# EasyEDA Pro project 第十二届蓝桥杯EDA国赛真题.eprj, board PCB7
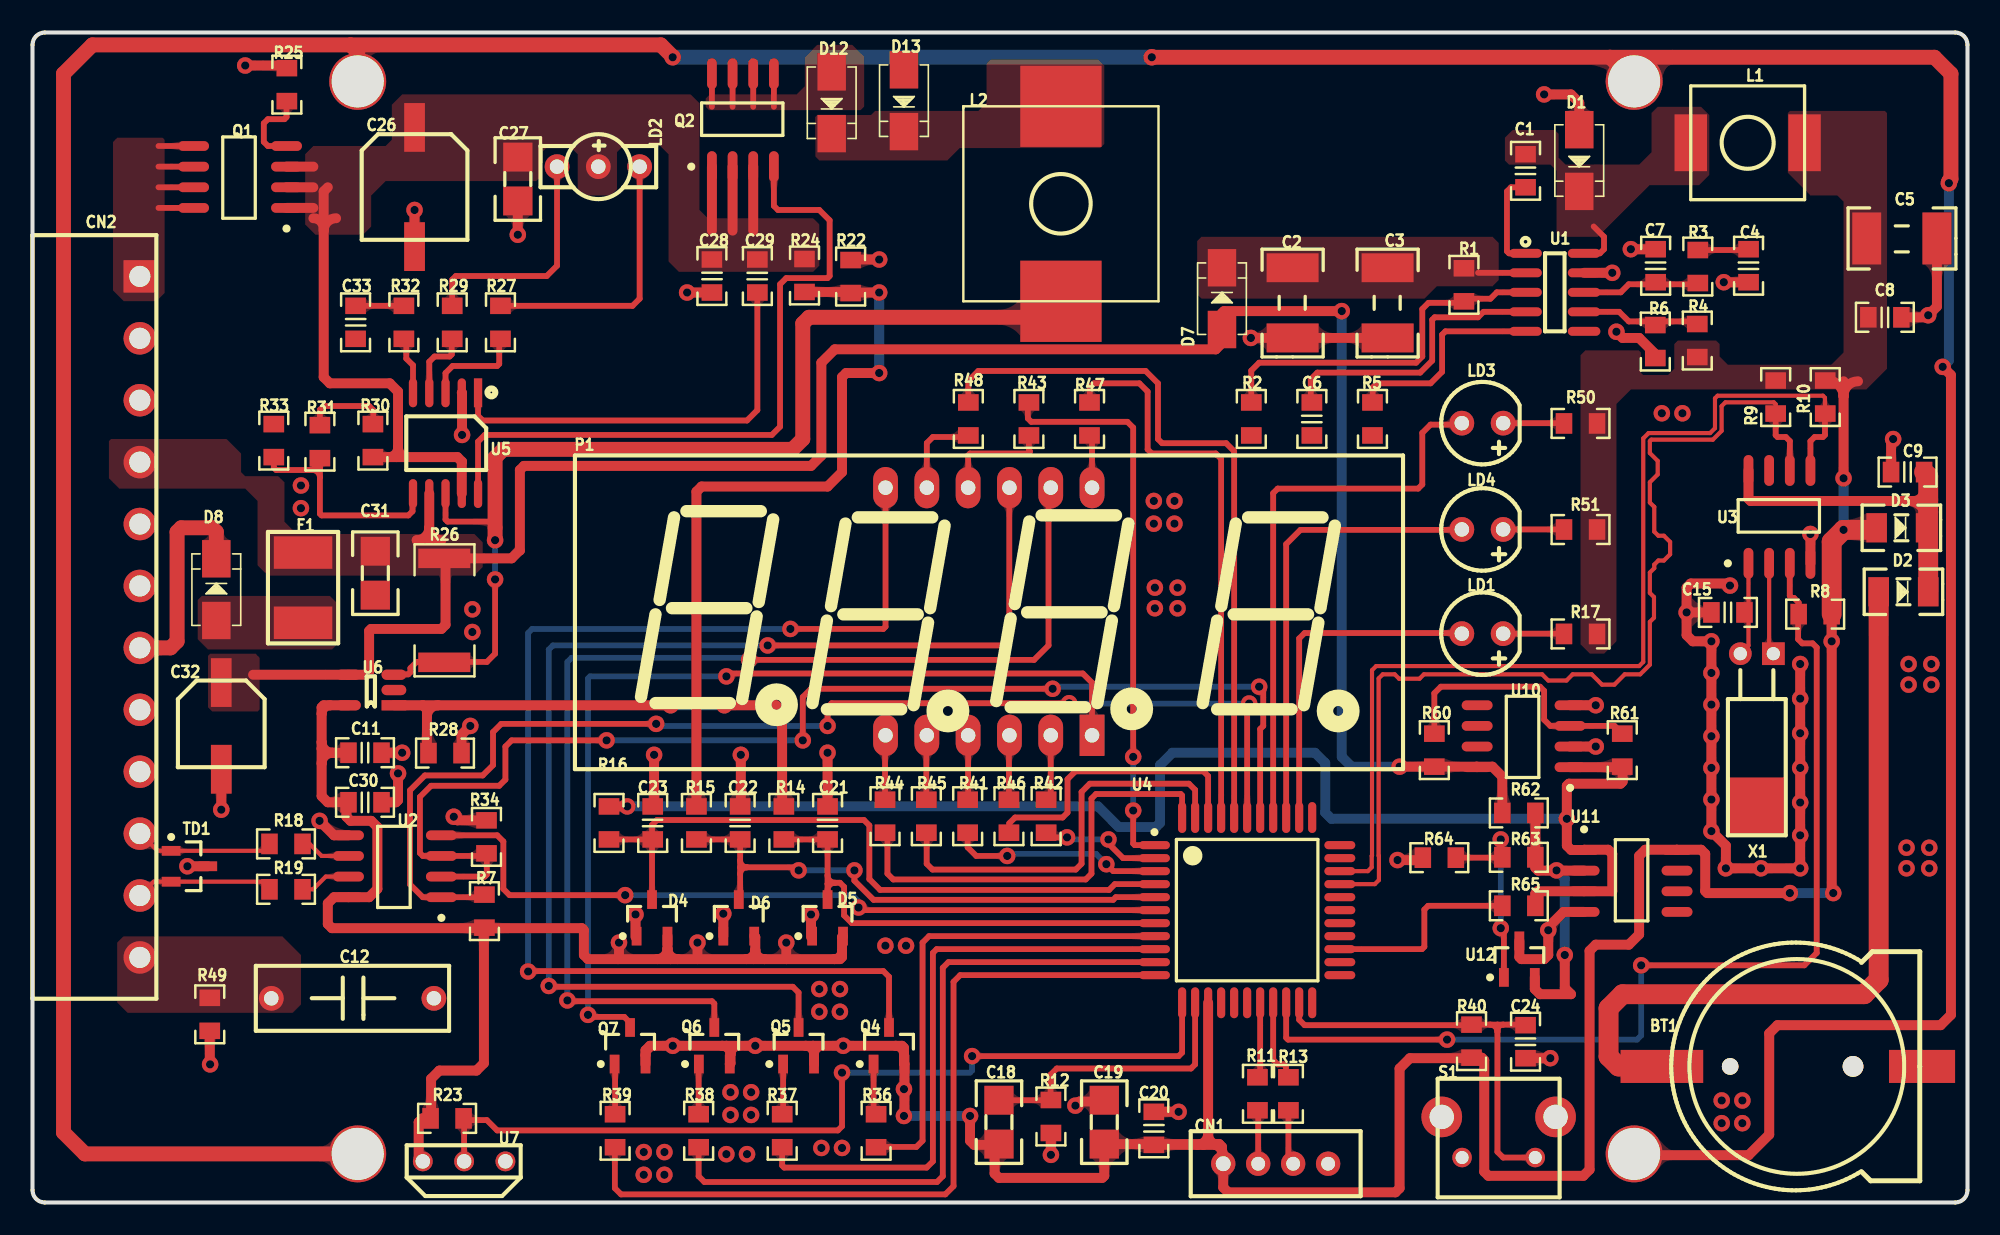
[diagram p1: board, top side]
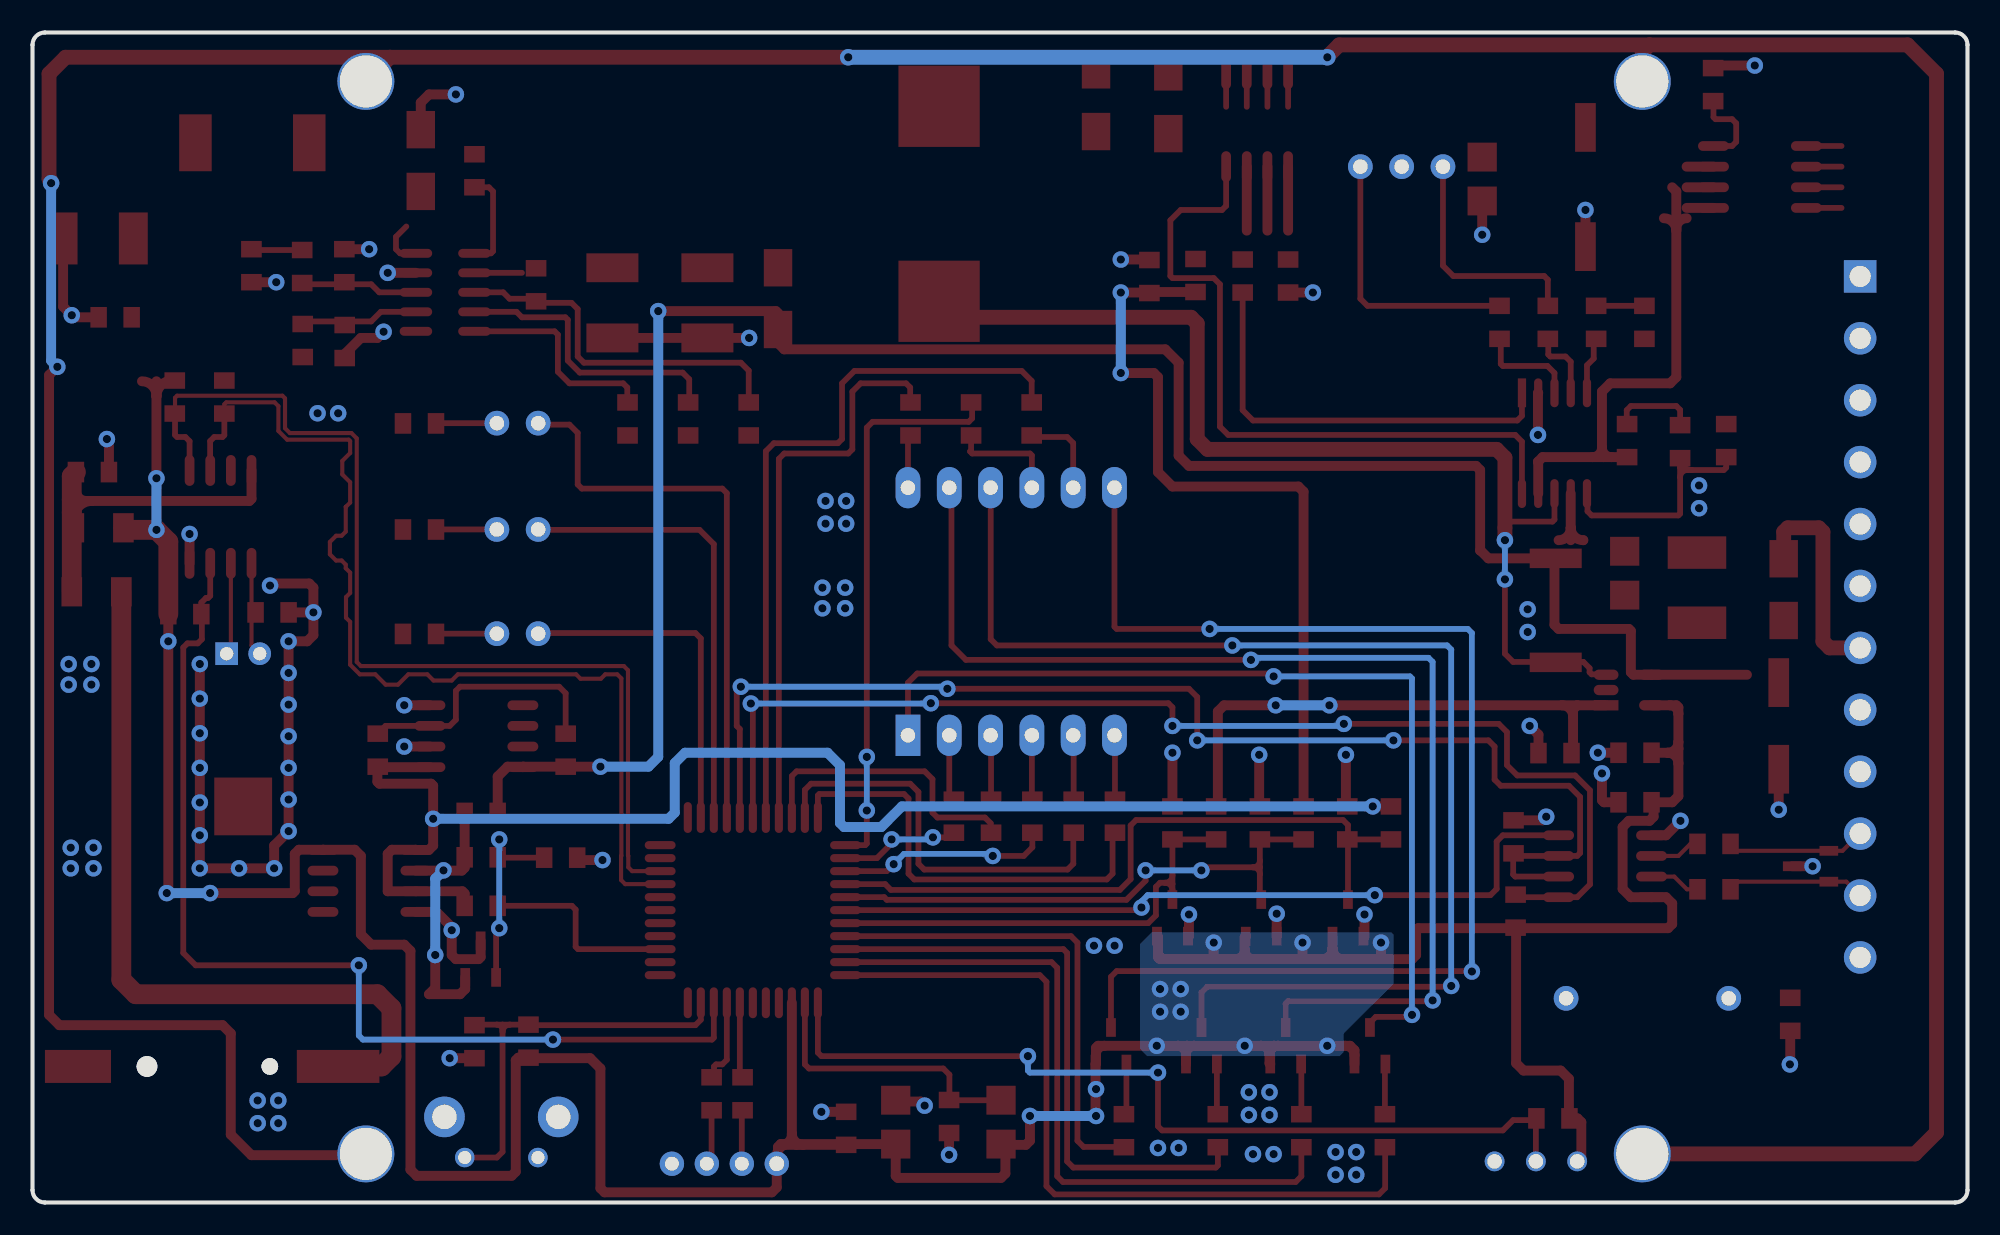
[diagram p2: board, bottom side, seen from below]

Outline 119 x 72 mm; copper layers: Top Layer, Bottom Layer. Coordinates in mm from the lower left corner of the outline.
Outline path: 0,71.24 0,0.76 arc(0.22,0.22) 0.76,0 118.24,0 arc(118.78,0.22) 119,0.76 119,71.24 arc(118.78,71.78) 118.24,72 0.76,72 arc(0.22,71.78) 0,71.24
Stack: Top Layer 0.035mm / Dielectric1 1.51mm FR4 er 4.5 / Bottom Layer 0.035mm

## Design rules (mm)
net RS485_A: DP1
net RS485_B: DP1
net I2C_SCL: DP4
net I2C_SDA: DP4
net $1N2229: DP2
net $1N2230: DP2
net $1N2244: DP3
net $1N2247: DP3
template: 自定义配置
spacing copperThickness1oz (default): track to track 0.254, other pairs 0.152 to 0.3
spacing copperThickness2oz: track to track 0.203, other pairs 0.152 to 0.3
track width copperThickness1oz (default): min 0.356, default 0.356, max 2.54
track width copperThickness2oz: min 0.203, default 0.254, max 2.54
track width PWR: min 0.356, default 0.61, max 2.54
differential pair differentialPair (default): width min 0.127, default 0.254, max 2.54; gap min 0.152, default 0.152
via viaSize (default): diameter min 1.016, default 1.016, max 10; hole min 0.508, default 0.508, max 6.299
net 0 uses PWR
net VBAT uses PWR
net GND uses PWR
net VLOAD uses PWR
net VIN uses PWR
net VDD uses PWR
net V_SUN uses PWR
net V_BAT uses PWR
net VREF uses PWR

## Placement (name value [footprint] x y rotation side)
BT1  S_BAT  [S_BAT-CR1220]  116.21 8.37 0 top
C1  100nF  [C_C0805]  91.82 64.51 270 top
C2  2.2uF/100V  [C_C1812]  77.47 55.39 270 top
C3  2.2uF/100V  [C_C1812]  83.31 55.39 270 top
C4  2200pF  [C_C0805]  105.54 58.67 270 top
C5  47uF  [C_C1812]  114.94 59.3 0 top
C6  10nF  [C_C0805]  78.68 49.24 270 top
C7  1.5pF  [C_C0805]  99.82 58.67 270 top
C8  100nF  [C_C0805]  112.9 54.47 0 top
C9  100nF  [C_C0805]  116.33 44.95 180 top
C11  100nF  [C_C0805]  19.43 24.63 0 top
C12  2200pF  [C_CAP-10]  19.69 12.56 180 top
C15  15pF  [C_C0805]  105.28 36.31 180 top
C18  47uF  [C_C1206]  59.44 4.94 90 top
C19  47uF  [C_C1206]  65.91 4.94 90 top
C20  100nF  [C_C0805]  68.96 3.55 90 top
C21  100nF  [C_C0805]  48.9 24.38 270 top
C22  100nF  [C_C0805]  43.52 24.38 270 top
C23  100nF  [C_C0805]  38.14 24.38 270 top
C24  100nF  [C_C0805]  91.82 10.91 270 top
C26  47uF  [C_CAP-6X7]  23.5 66.16 270 top
C27  10uF  [C_C1206]  29.84 62.98 90 top
C28  100nF  [C_C0805]  41.78 56 90 top
C29  100nF  [C_C0805]  44.58 58.03 270 top
C30  100nF  [C_C0805]  21.46 27.68 180 top
C31  10uF  [C_C1206]  21.08 38.73 270 top
C32  47uF  [C_CAP-5X5]  11.68 32.12 270 top
C33  220nF  [C_C0805]  19.87 53.15 90 top
CN1  4-Pin  [SIP-4]  73.23 2.39 90 top
CN2  Header 12H  [SIP12-3.81]  6.6 56.99 270 top
D1  SS34  [D_DIO-SMA]  95.12 66.03 270 top
D2  1N4148  [D_DIO-SMT]  115.06 37.58 0 top
D3  1N4148  [D_DIO-SMT]  114.94 41.52 0 top
D4  BAT54S  [SOP-SOT23-3]  38.1 17.52 90 top
D5  BAT54S  [SOP-SOT23-3]  48.9 17.52 90 top
D6  BAT54S  [SOP-SOT23-3]  43.43 17.52 90 top
D7  SS34  [D_DIO-SMA]  73.15 53.71 90 top
D8  SS34  [D_DIO-SMA]  11.3 35.81 90 top
D12  SS34  [D_DIO-SMA]  49.15 69.59 270 top
D13  SS34  [D_DIO-SMA]  53.59 69.71 270 top
F1  PTS181224V150  [F_Fuse_1812]  16.64 40 270 top
L1  100uH  [L_L7X7X4]  101.98 65.27 270 top
L2  100uH  [L_L12x12]  63.25 61.46 270 top
LD1  Red  [D_LED-3MM]  89.17 35.01 270 top
LD2  LED-2COLOR  [共阳极双色LED]  34.8 63.75 180 top
LD3  Red  [D_LED-3MM]  89.17 47.96 270 top
LD4  Red  [D_LED-3MM]  89.17 41.42 270 top
NOREF  -  [Pad_e126]  20 68.99 90 top
NOREF#2  -  [Pad_e127]  98.5 2.99 90 top
NOREF#3  -  [Pad_e128]  98.5 68.99 90 top
NOREF#4  -  [Pad_e124]  20 2.99 90 top
P1  SEG.36  [D_SEG-0.56]  55 43.99 0 top
Q1  AO4459  [SOP-8]  15.62 61.21 180 top
Q2  AO4459  [SOP-8]  41.78 63.75 90 top
Q4  S8550  [SOP-SOT23-3]  52.67 9.65 90 top
Q5  S8550  [SOP-SOT23-3]  47.11 9.65 90 top
Q6  S8550  [SOP-SOT23-3]  41.93 9.65 90 top
Q7  S8550  [SOP-SOT23-3]  36.75 9.65 90 top
R1  1K  [R_R0805]  88.01 55.49 90 top
R2  1K  [R_R0805]  74.93 47.24 90 top
R3  1K  [R_R0805]  102.44 58.58 270 top
R4  1K  [R_R0805]  102.36 52.06 90 top
R5  1K  [R_R0805]  82.39 47.24 90 top
R6  1K  [R_R0805]  99.82 53.97 270 top
R7  1K  [R_R0805]  27.81 18.91 270 top
R8  1K  [R_R0805]  110.62 36.19 180 top
R9  1K  [R_R0805]  107.18 48.58 90 top
R10  1K  [R_R0805]  110.23 48.58 90 top
R11  1K  [R_R0805]  75.31 5.71 90 top
R12  1K  [R_R0805]  62.61 4.31 90 top
R13  1K  [R_R0805]  77.22 5.71 90 top
R14  1K  [R_R0805]  46.19 22.38 90 top
R15  1K  [R_R0805]  40.81 22.38 90 top
R16  1K  [R_R0805]  35.43 22.38 90 top
R17  1K  [R_R0805]  96.19 34.97 180 top
R18  1K  [R_R0805]  14.61 22.09 0 top
R19  1K  [R_R0805]  14.61 19.3 0 top
R22  1K  [R_R0805]  50.29 56 90 top
R23  1K  [R_R0805]  24.51 5.2 0 top
R24  1K  [R_R0805]  47.5 58.03 270 top
R25  1K  [R_R0805]  15.62 67.81 90 top
R26  1K  [R_R2512]  25.4 33.27 90 top
R27  1K  [R_R0805]  28.76 53.18 90 top
R28  1K  [R_R0805]  24.38 27.68 0 top
R29  1K  [R_R0805]  25.79 53.18 90 top
R30  1K  [R_R0805]  20.95 47.87 270 top
R31  1K  [R_R0805]  17.65 45.84 90 top
R32  1K  [R_R0805]  22.82 53.18 90 top
R33  1K  [R_R0805]  14.86 47.87 270 top
R34  1K  [R_R0805]  27.94 23.49 270 top
R36  1K  [R_R0805]  51.86 3.43 90 top
R37  1K  [R_R0805]  46.08 3.43 90 top
R38  1K  [R_R0805]  40.95 3.43 90 top
R39  1K  [R_R0805]  35.81 3.43 90 top
R40  1K  [R_R0805]  88.52 10.91 270 top
R41  1K  [R_R0805]  57.53 24.76 270 top
R42  1K  [R_R0805]  62.36 24.76 270 top
R43  1K  [R_R0805]  61.26 47.24 90 top
R44  1K  [R_R0805]  52.45 24.76 270 top
R45  1K  [R_R0805]  54.99 24.76 270 top
R46  1K  [R_R0805]  60.07 24.76 270 top
R47  1K  [R_R0805]  64.98 47.24 90 top
R48  1K  [R_R0805]  57.53 47.24 90 top
R49  1K  [R_R0805]  10.92 12.56 270 top
R50  1K  [R_R0805]  96.19 47.92 180 top
R51  1K  [R_R0805]  96.19 41.39 180 top
R60  1K  [R_R0805]  86.23 28.82 270 top
R61  1K  [R_R0805]  97.79 28.82 270 top
R62  1K  [R_R0805]  90.42 23.99 0 top
R63  1K  [R_R0805]  92.39 21.22 180 top
R64  1K  [R_R0805]  87.5 21.2 180 top
R65  1K  [R_R0805]  90.42 18.28 0 top
S1  SW-PB  [SW_BTN4 - LYING]  90.17 5.27 270 top
TD1  CDSOT23-SM712  [SOP-SOT23-3]  9.65 20.69 0 top
U1  DC-DC  [SMD-10]  91.82 58.41 0 top
U2  SN65HVD75  [SOP-8]  25.15 18.79 180 top
U3  U_PCF8563  [SOP-8]  105.53 39.33 90 top
U4  U_IAP15F2K61S2  [QFP-LQFP-44]  69 21.99 0 top
U5  CN3767  [SOP-SSOP-10]  25.4 46.73 270 top
U6  INA168  [SOP-SOT23-5]  22.22 30.6 180 top
U7  DS18B20  [S_DS18B20]  29.08 2.53 180 top
U10  U_LM358  [SOP-8]  94.56 26.79 180 top
U11  U_LM393  [SOP-8]  95.42 21.69 0 top
U12  TL431  [SOP-SOT23-3]  91.44 14.98 90 top
X1  32.768kHz  [XTAL-DT38]  107.06 33.77 0 top

## Footprints (pads in the part's own frame, mm; a bottom-side part is the same pattern mirrored in y, then rotated)
C_C0805
  rect 1.016x1.27 smd: 1(0,0) 2(2.032,0)
C_C1206
  rect 1.778x1.8 smd: 1(-1.35,0) 2(1.35,0)
C_C1812
  rect 1.778x3.2 smd: 1(-2.134,0.025) 2(2.184,0.025)
C_CAP-5X5
  rect 3x1.274 smd: 1(0.127,-0.076) 2(5.461,-0.076)
C_CAP-6X7
  rect 3x1.274 smd: 1(0,0) 2(7.334,0)
C_CAP-10
  round 1.524 hole 0.889: 1(-5,0) 2(5,0)
D_DIO-SMA
  rect 2.3x1.75 smd: 1(0.01,0) 2(3.81,0)
D_DIO-SMT
  rect 1.27x1.8 smd: 1(-1.524,0) 2(1.524,0)
D_LED-3MM
  round 1.524 hole 0.889: 1(0,1.27) 2(0,-1.27)
D_SEG-0.56
  oval 1.524x2.54 hole 0.889: 1(0,0) 2(10.16,0) 3(5.08,-15.24) 4(0,-15.24) 5(-2.54,-15.24) 6(2.54,0) 7(7.62,-15.24) 8(2.54,-15.24) 9(-2.54,0) 10(5.08,0) 11(7.62,0)
  rect 1.524x2.54 hole 0.889: 12(10.16,-15.24)
F_Fuse_1812
  rect 2x3.6 smd: 1(0,0) 2(4.318,0)
L_L7X7X4
  rect 3.5x2 smd: 1(0.056,0) 2(0.056,7)
L_L12x12
  rect 5x5 smd: 1(-6,0) 2(6,0)
Pad_e124
  round 3.5 hole 3.2: 45(0,0)
Pad_e126
  round 3.5 hole 3.2: 45(0,0)
Pad_e127
  round 3.5 hole 3.2: 45(0,0)
Pad_e128
  round 3.5 hole 3.2: 45(0,0)
QFP-LQFP-44
  oval 1.9x0.5 smd: 1(0,0) 2(0,-0.8) 3(0,-1.6) 4(0,-2.4) 5(0,-3.2) 6(0,-4) 7(0,-4.8) 8(0,-5.6) 9(0,-6.4) 10(0,-7.2) 11(0,-8) 23(11.4,-8) 24(11.4,-7.2) 25(11.4,-6.4) 26(11.4,-5.6) 27(11.4,-4.8) 28(11.4,-4) 29(11.4,-3.2) 30(11.4,-2.4) 31(11.4,-1.6) 32(11.4,-0.8) 33(11.4,0)
  oval 0.5x1.9 smd: 12(1.7,-9.7) 13(2.5,-9.7) 14(3.3,-9.7) 15(4.1,-9.7) 16(4.9,-9.7) 17(5.7,-9.7) 18(6.5,-9.7) 19(7.3,-9.7) 20(8.1,-9.7) 21(8.9,-9.7) 22(9.7,-9.7) 34(9.7,1.7) 35(8.9,1.7) 36(8.1,1.7) 37(7.3,1.7) 38(6.5,1.7) 39(5.7,1.7) 40(4.9,1.7) 41(4.1,1.7) 42(3.3,1.7) 43(2.5,1.7) 44(1.7,1.7)
R_R0805
  rect 1.016x1.27 smd: 1(-0.032,-0.021) 2(2,-0.021)
R_R2512
  rect 1.2x3.2 smd: 1(-0.025,0.076) 2(6.375,0.076)
S_BAT-CR1220
  round 1.016 hole 1.016: 0(-11.8,0)
  round 1.27 hole 1.27: 0(-4.244,0)
  rect 4.064x2.032 smd: 1(0,0)
  rect 5.08x2.032 smd: 2(-16,0)
S_DS18B20
  round 1.219 hole 0.889: 1(0,0) 2(2.54,0) 3(5.08,0)
SIP12-3.81
  rect 2x2 hole 1.3: 1(0,0)
  round 2 hole 1.3: 2(3.81,0) 3(7.62,0) 4(11.43,0) 5(15.24,0) 6(19.05,0) 7(22.86,0) 8(26.67,0) 9(30.48,0) 10(34.29,0) 11(38.1,0) 12(41.91,0)
SIP-4
  round 1.5 hole 0.914x0.85: 1(0,0)
  round 1.5 hole 0.85: 2(0,-2.15) 3(0,-4.3) 4(0,-6.45)
SMD-10
  oval 2x0.55 smd: 1(0,0) 2(0,-1.2) 3(0,-2.4) 4(0,-3.6) 5(0,-4.8) 6(3.6,-4.8) 7(3.6,-3.6) 8(3.6,-2.4) 9(3.6,-1.2) 10(3.6,0)
SOP-8
  oval 1.9x0.6 smd: 1(0,0) 2(0,-1.27) 3(0,-2.54) 4(0,-3.81) 5(5.716,-3.81) 6(5.716,-2.54) 7(5.716,-1.27) 8(5.716,0)
SOP-SOT23-3
  rect 1.15x0.6 smd: 1(-1.125,0.95) 2(-1.125,-0.95) 3(1.125,0)
SOP-SOT23-5
  rect 1.524x0.635 smd: 1(0,0)
  oval 1.524x0.635 smd: 2(0,-0.94) 3(0,-1.879) 4(2.794,-1.879) 5(2.794,0)
SOP-SSOP-10
  rect 1.778x0.508 smd: 1(-3.1,2)
  oval 1.778x0.508 smd: 2(-3.1,1) 3(-3.1,0) 4(-3.1,-1) 5(-3.1,-2) 6(3.1,-2) 7(3.1,-1) 8(3.1,0) 9(3.1,1) 10(3.1,2)
SW_BTN4 - LYING
  round 2.5 hole 1.5: 0(0,3.5) 0(0,-3.5)
  round 1.2 hole 0.8: 1(2.5,2.25) 2(2.5,-2.25)
XTAL-DT38
  rect 3.556x3.556 smd: 0(-1.016,-9.398)
  rect 1.397x1.397 hole 0.813: 1(0,0)
  round 1.397 hole 0.813: 2(-2.032,0)
共阳极双色LED
  round 1.524 hole 0.889: 1(0,0) 2(-2.54,0) 3(2.54,0)

## Nets
As in the schematic, except:
PAD: NOREF.45 NOREF#2.45 NOREF#3.45 NOREF#4.45

Pads without a net: BT1 0; S1 0; U1 6; U3 7; U4 17 22 23 24 26 27 28 29 32 33 34; U10 5 6 7; U11 5 6 7

## Via types
v1: diameter 1.016, hole 0.508, Top Layer to Bottom Layer, 161 vias

## Routing (per net, layer and track width the routed paths; a pad name or vN(x,y) marks a point on that pad's centre or on a via; arc(x,y) is an arc through that point)
GND: length 132.4
  Top Layer w0.61: D6.1 v1(42.48,17.77) ; v1(74.93,53.2) C2.2 C3.2 ; C28.1 v1(40.26,56) ; v1(101.73,36.31) 101.73,34.92 102.11,34.54 v1(103.25,34.54) v1(103.25,32.59) v1(103.25,30.64) v1(103.25,28.69) v1(103.25,26.75) v1(103.25,24.8) v1(103.25,22.85) 104.14,21.96 v1(104.14,20.57) v1(106.3,20.57) v1(108.71,20.57) v1(108.71,22.6) v1(108.71,24.61) v1(108.71,26.75) v1(108.71,28.88) v1(108.71,31.01) v1(108.71,33.14) ; v1(101.73,36.31) 101.73,37.84 101.98,38.09 104.27,38.09 v1(104.39,37.96) ; v1(101.73,36.31) 103.25,36.31 ; C4.2 v1(104.01,56.63) ; U12.3 91.44,15.1 91.57,14.98 92.96,14.98 93.22,15.23 v1(93.22,16.76) 93.22,16.94 94.16,17.88 U11.4 ; v1(38.23,27.55) 38.23,24.46 C23.1 ; C5.2 117.12,55.13 v1(116.59,54.6) 116.46,54.47 C8.2 ; C9.2 114.3,46.85 v1(114.43,46.98) ; R64.2 85.35,21.07 v1(83.95,21.07) ; 94.56,30.6 v1(96.14,30.6) ; v1(26.42,47.24) 26.42,49.81 U5.2 ; C32.2 v1(11.61,24.17) ; U2.5 18.54,22.6 v1(17.65,23.49) ; v1(97.41,53.59) 97.79,53.2 98.81,53.2 99.8,52.21 99.8,51.97 ; U10.2 v1(96.14,28.06) ; v1(64.13,5.96) 64.39,6.21 65.83,6.21 C19.2 ; R28.2 26.38,28.79 v1(26.92,29.33) ; v1(22.48,26.41) 22.48,24.76 22.35,24.63 C11.2 ; TD1.3 v1(9.53,20.69) ; v1(93.34,8.88) C24.2 ; v1(10.92,8.5) 10.9,8.52 10.9,10.56 ; C20.2 v1(70.49,5.58) ; v1(43.56,27.55) 43.56,24.42 C22.1 ; D1.1 95.12,67.68 94.62,68.19 v1(92.96,68.19) ; 47.88,16.35 v1(47.88,17.72) ; C21.1 v1(48.9,27.68) ; v1(25.91,23.74) 26.13,23.52 R34.1 ; U1.9 v1(97.16,57.21) ; R25.2 15.48,69.97 v1(13.08,69.97) ; C26.2 v1(23.5,61.08) ; v1(52.07,58.03) 50.34,58.03 R22.2 ; C30.1 v1(22.73,27.68) ; C27.1 v1(29.84,59.55) ; 37.08,16.35 v1(37.08,17.72) ; R12.1 v1(62.63,2.93) ; C7.1 v1(98.3,58.67) ; U3.4 v1(109.34,41.14)
  Bottom Layer w0.61: v1(109.34,41.14) 109.35,41.14 ; v1(42.48,17.77) 42.42,17.77
  vias: v1(16.51,44.12) v1(16.51,42.73) v1(27.05,35.11) v1(27.05,36.5) v1(37.59,3.1) v1(37.59,1.71) v1(38.86,3.1) v1(38.86,1.71) v1(42.67,2.98) v1(42.93,6.79) v1(42.93,5.39) v1(43.94,2.98) v1(44.2,6.79) v1(44.19,5.39) v1(48.51,3.36) v1(49.78,3.36) v1(52.45,15.8) v1(53.72,15.8) v1(68.96,43.17) v1(68.96,41.77) v1(69.02,37.84) v1(69.02,36.57) v1(70.23,43.17) v1(70.23,41.77) v1(70.42,37.83) v1(70.42,36.57) v1(100.2,48.57) v1(101.47,48.57) v1(103.89,6.28) v1(103.89,4.88) v1(105.16,6.28) v1(105.15,4.88) v1(115.25,21.84) v1(115.25,20.57) v1(115.38,33.14) v1(115.38,31.87) v1(116.65,21.83) v1(116.65,20.57) v1(116.78,33.14) v1(116.78,31.87)
VBAT: length 132.9
  Top Layer w0.61: 23.62,40.76 23.64,40.76 arc(24.18,40.98) 24.4,41.52 ; 88.81,26.82 U10.8 ; 88.81,26.82 R60.2 v1(84.07,26.82) ; 88.81,26.82 89.78,26.82 90.39,26.21 R62.1 ; 24.4,41.52 24.4,41.5 ; 24.4,41.52 U5.7 ; 24.4,41.5 24.4,40.76 ; 24.4,41.5 arc(24.62,40.98) 25.15,40.76 ; v1(80.52,54.86) 73.28,54.86 73.15,54.73 D7.1 73.15,52.88 72.77,52.5 49.34,52.5 48.51,51.68 48.51,45.97 47.88,45.33 30.23,45.33 29.97,45.08 29.97,40.12 29.95,40.12 29.46,39.64 R26.2 25.4,39.56 25.4,35.55 25.15,35.3 20.83,35.3 20.7,35.17 20.7,32.63 20.55,32.48 U6.4 13.56,32.48
  Bottom Layer w0.61: v1(80.52,54.86) 80.52,27.42 81.12,26.82 v1(84.07,26.82)
VDD: length 271.7
  Top Layer w0.61: 38.42,14.98 36.01,14.98 ; 38.42,14.98 39.24,14.98 ; 38.42,14.98 arc(38.86,15.16) 39.05,15.61 ; 36.01,14.98 36.07,15.03 v1(36.07,15.99) ; 36.01,14.98 34.16,14.98 33.91,15.23 33.91,16.76 33.78,16.88 28.07,16.88 ; 111.38,49.65 111.38,50.54 ; 111.38,49.65 111.38,49.61 ; 111.38,49.65 arc(111.64,50.28) 112.27,50.54 ; 44.45,15.54 44.45,16.33 D6.2 ; 44.45,15.54 44.45,15.1 44.32,14.98 ; 44.45,15.54 arc(44.61,15.14) 45.01,14.98 ; 44.45,15.54 arc(44.29,15.14) 43.89,14.98 ; 48.06,9.14 48.06,9.45 48.13,9.52 48.01,9.64 ; 48.06,9.14 Q5.2 ; 48.06,9.14 arc(47.91,9.5) 47.56,9.64 ; 48.06,9.14 arc(48.21,9.5) 48.57,9.64 ; 68.91,3.59 C20.1 71.61,3.55 ; 68.91,3.59 C19.1 65.91,1.64 65.79,1.52 59.44,1.52 59.17,1.78 59.17,3.55 ; 68.91,3.59 71.86,3.59 ; D5.2 49.78,16.33 49.78,15.45 ; 19.3,24.38 19.3,23.74 19.56,23.49 20.83,23.49 21.21,23.11 21.21,19.3 20.7,18.79 U2.8 18.54,18.79 18.16,18.41 18.16,17.14 18.42,16.88 27.76,16.88 ; R8.1 v1(110.65,34.54) 110.65,19.14 v1(110.74,19.04) ; CN1.1 73.23,2.86 arc(73.21,3.03) 73.15,3.19 ; CN1.1 73.15,2.46 73.15,3.19 ; CN1.1 73.23,0.93 73.53,0.63 83.82,0.63 84.07,0.88 84.07,8.25 84.71,8.88 88.47,8.88 R40.2 89.12,8.91 89.28,8.75 89.28,1.9 89.53,1.64 95.38,1.64 95.76,2.02 95.76,15.49 96.14,15.87 98.17,15.87 98.81,16.5 98.81,21.33 99.19,21.71 101.12,21.71 ; 17.78,30.08 17.78,30.47 17.91,30.6 18.3,30.6 ; 17.78,30.08 17.78,28.33 ; 17.78,30.08 arc(17.93,30.45) 18.3,30.6 ; 17.78,27.93 17.78,28.33 ; 17.78,27.93 18.03,27.68 18.44,27.68 ; 17.78,27.93 17.78,27.02 ; 17.78,28.33 arc(17.97,27.87) 18.44,27.68 ; v1(53.59,5.33) 53.62,5.36 Q4.2 53.59,8.55 53.59,9.13 ; v1(40.89,15.99) 40.89,14.99 40.88,14.98 ; 101.12,21.71 U11.8 ; 101.12,21.71 102.62,21.71 102.87,21.45 102.87,19.17 103,19.04 v1(108.08,19.04) ; 48.01,9.64 48.57,9.64 ; 48.01,9.64 47.56,9.64 ; 48.57,9.64 v1(49.86,9.64) 53.08,9.64 ; Q7.2 37.7,9.08 ; 37.7,9.08 37.7,9.37 37.97,9.64 38.27,9.64 ; 37.7,9.08 arc(37.86,9.48) 38.27,9.64 ; 72.98,3.59 73.15,3.42 73.15,3.19 ; 72.98,3.59 72.69,3.59 ; 72.98,3.59 arc(72.96,3.56) 72.93,3.55 ; 42.41,9.64 v1(39.38,9.64) 38.27,9.64 ; 42.41,9.64 42.67,9.64 ; 42.41,9.64 arc(42.78,9.49) 42.93,9.13 ; 44.32,14.98 43.89,14.98 ; 44.32,14.98 45.01,14.98 ; 43.89,14.98 40.88,14.98 ; 43.44,9.64 v1(44.45,9.64) 47.56,9.64 ; 43.44,9.64 42.67,9.64 ; 43.44,9.64 arc(43.08,9.49) 42.93,9.13 ; 59.17,3.55 59.39,3.55 C18.1 ; 59.17,3.55 57.91,3.55 57.66,3.8 v1(57.66,5.33) ; 49.78,15.45 49.78,15.1 49.66,14.98 49.31,14.98 ; 49.78,15.45 arc(49.65,15.12) 49.31,14.98 ; 72.5,3.59 72.69,3.59 ; 72.5,3.59 72.06,3.59 ; 72.5,3.59 arc(72.63,3.58) 72.75,3.55 ; 72.69,3.59 arc(72.81,3.56) 72.93,3.55 ; 72.69,3.59 arc(72.41,3.83) 72.3,4.18 ; 18.3,30.6 U6.5 ; 49.31,14.98 46.38,14.98 ; 46.38,14.98 46.35,15 v1(46.35,15.99) ; 46.38,14.98 45.01,14.98 ; 72.06,3.59 72.3,3.84 72.3,4.18 ; 72.06,3.59 72.01,3.55 ; 72.06,3.59 71.86,3.59 ; 72.3,4.18 72.3,4.23 ; 72.3,4.23 U4.14 ; 72.3,4.23 arc(72.18,3.85) 71.86,3.59 ; 72.75,3.55 72.93,3.55 ; 72.75,3.55 72.01,3.55 ; 72.75,3.55 arc(72.99,3.41) 73.15,3.19 ; 42.67,9.64 42.93,9.39 42.93,9.13 ; 18.44,27.68 C30.2 ; 18.44,27.68 arc(17.97,27.48) 17.78,27.02 ; 40.88,14.98 39.68,14.98 ; U7.3 23.75,2.79 23.75,4.94 23.98,5.18 R23.1 24.51,5.21 24.51,7.61 25.02,8.12 27.31,8.12 27.76,8.57 27.76,16.88 ; 27.76,16.88 R7.2 ; 53.08,9.64 53.47,9.64 53.59,9.52 53.59,9.13 ; 53.08,9.64 arc(53.44,9.49) 53.59,9.13 ; 72.01,3.55 71.61,3.55 ; 17.78,27.02 17.78,25.01 18.16,24.63 C11.1 ; 71.86,3.59 arc(71.74,3.56) 71.61,3.55 ; Q6.2 42.93,8.57 42.93,9.13 ; 39.24,14.98 39.05,15.17 39.05,15.61 ; 39.24,14.98 39.68,14.98 ; 39.05,15.61 D4.2 ; 39.05,15.61 arc(39.24,15.16) 39.68,14.98 ; 111.38,49.61 v1(111.38,44.57) ; 111.38,49.61 arc(111.09,50.3) 110.4,50.58 R10.2
  Top Layer w1.219: R8.1 110.65,40.66 v1(111.38,41.39) 113.28,41.39 D3.1
  Bottom Layer w0.61: v1(53.59,5.33) v1(57.66,5.33) ; v1(110.74,19.04) v1(108.08,19.04) ; v1(111.38,41.39) v1(111.38,44.57)
  vias: v1(48.39,13.14) v1(48.39,11.74) v1(49.66,13.14) v1(49.65,11.74) v1(53.59,6.98)
VIN: length 49.1
  Top Layer w0.61: 22.38,45.87 22.48,45.97 22.48,46.44 ; 22.38,45.87 23.05,45.87 ; 22.38,45.87 21.91,45.87 ; 22.48,46.44 22.48,49.9 21.97,50.41 18.29,50.41 17.91,50.79 17.91,59.81 ; 22.48,46.44 arc(22.65,46.04) 23.05,45.87 ; 22.48,46.44 arc(22.31,46.04) 21.91,45.87 ; 17.91,59.81 17.91,59.94 ; 17.91,59.81 arc(18.13,60.35) 18.67,60.57 ; 44.32,63.75 44.32,59.81 ; U5.9 26.4,45.57 26.42,45.58 26.13,45.87 23.05,45.87 ; Q1.1 17.27,61.21 ; Q1.3 17.27,63.75 ; 21.91,45.87 R30.2 ; 18.16,62.48 17.91,62.22 17.91,59.94 ; 17.91,59.94 arc(17.72,60.38) 17.27,60.57 ; Q2.2 43.05,59.81 ; Q1.2 17.27,62.48 ; Q2.1 41.78,59.81
C_BAT: length 34.1
  Top Layer w0.61: 24,30.6 24.94,30.6 ; 24,30.6 U6.1 ; 24,30.6 24.26,30.34 24.26,29.92 ; 24.94,30.6 v1(39.24,30.6) ; 24.94,30.6 arc(24.46,30.4) 24.26,29.92 ; 24.26,29.92 24.26,27.75 R28.1 ; R14.2 46.1,24.48 46.1,30.22 45.72,30.6 v1(42.54,30.6)
  Bottom Layer w0.61: v1(39.24,30.6) v1(42.54,30.6)
COM1: length 77
  Top Layer w0.355: v1(46.61,35.3) 52.32,35.3 52.46,35.43 P1.9 ; Q4.3 52.67,13.89 52.32,14.24 30.51,14.24 v1(30.48,14.22)
  Bottom Layer w0.355: v1(46.61,35.3) 30.73,35.3 30.48,35.04 v1(30.48,14.22)
COM2: length 76.3
  Top Layer w0.355: v1(45.21,34.28) 59.69,34.28 60.07,34.66 60.07,43.98 P1.10 ; Q5.3 47.11,12.92 46.76,13.28 31.8,13.28 v1(31.75,13.33)
  Bottom Layer w0.355: v1(45.21,34.28) 32,34.28 31.75,34.03 v1(31.75,13.33)
COM3: length 71.3
  Top Layer w0.355: Q6.3 41.93,12.24 41.78,12.39 32.94,12.39 v1(32.89,12.44) ; P1.11 62.48,43.86 62.48,34.28 61.59,33.39 v1(44.07,33.39)
  Bottom Layer w0.355: v1(44.07,33.39) 43.94,33.52 33.15,33.52 32.89,33.27 v1(32.89,12.44)
COM4: length 58.4
  Top Layer w0.355: v1(34.16,11.55) 34.29,11.42 36.39,11.42 36.75,11.07 Q7.3 ; v1(42.67,32.38) 42.85,32.55 64.59,32.55 65.16,31.99 P1.12
  Bottom Layer w0.355: v1(42.67,32.38) 34.29,32.38 34.16,32.25 v1(34.16,11.55)
GA: length 5.5
  Top Layer w0.355: P1.1 55,46.74 55.37,47.11 57.46,47.11 R48.1
GB: length 3.3
  Top Layer w0.355: P1.2 65.16,47.05 R47.1
GC: length 4.2
  Top Layer w0.355: 60.05,24.53 60.05,28.72 P1.3
GD: length 4.2
  Top Layer w0.355: P1.4 54.97,28.72 54.97,24.53
GDP: length 4.2
  Top Layer w0.355: 57.51,24.53 57.54,24.56 P1.8
GE: length 4.2
  Top Layer w0.355: P1.5 52.43,28.72 52.43,24.53
GF: length 6.9
  Top Layer w0.355: R43.1 61.28,46.28 61.34,46.22 61.21,46.09 57.66,46.09 57.54,45.97 P1.6
GG: length 4.2
  Top Layer w0.355: 62.59,24.53 62.62,24.56 P1.7
I2C_SCL: length 63.2
  Top Layer w0.254: R9.1 107.2,49.12 107.09,49.24 104.11,49.24 103.88,49.01 103.88,47.48 103.34,46.94 99.56,46.94 99.47,46.85 99.47,46.12 99.95,45.64 99.95,44.81 99.47,44.33 99.47,43.07 99.72,42.82 99.73,42.82 99.74,42.81 99.74,41.29 99.99,41.03 100.33,41.03 100.71,40.65 100.71,39.89 100.33,39.51 99.99,39.51 99.74,39.25 99.74,39.03 99.47,38.76 99.47,37.51 99.72,37.26 99.72,35.99 99.47,35.73 99.47,33.1 98.87,32.5 97.92,32.5 97.28,31.87 96.52,31.87 95.89,32.5 94.72,32.5 94.34,32.12 93.22,32.12 92.84,32.5 85.57,32.5 85.3,32.23 84.04,32.23 83.77,32.5 83.04,32.5 82.79,32.25 82.79,21.35 82.8,21.33 82.8,19.85 82.55,19.59 U4.30
  Top Layer w0.355: U3.6 108.08,45.05 108.08,46.85 107.82,47.11 107.31,47.11 107.2,47.22 R9.1
I2C_SDA: length 63.4
  Top Layer w0.254: U4.31 82.12,20.39 82.36,20.63 82.36,21.33 82.38,21.35 82.38,32.76 82.63,33.01 98.81,33.01 99.06,33.27 99.06,47.02 99.39,47.35 103.17,47.35 103.47,47.65 103.47,49.49 103.63,49.65 110.11,49.65 110.24,49.52 110.24,48.44 110.25,48.42
  Top Layer w0.355: U3.5 109.34,46.85 109.6,47.11 110.11,47.11 110.24,47.24 110.24,48.41 110.25,48.42
INT0: length 64.7
  Top Layer w0.355: v1(98.93,14.6) 108.97,14.6 109.73,15.36 109.73,34.15 109.47,34.41 108.84,34.41 108.59,34.66 108.59,36.18 R8.2 108.62,36.92 108.33,37.2 108.2,37.2 108.07,37.33 U3.3 ; v1(87,10.02) 77.22,10.02 77.1,10.14 U4.20
  Bottom Layer w0.355: v1(87,10.02) 98.68,10.02 98.93,10.28 v1(98.93,14.6)
MCU_RX2: length 73.6
  Top Layer w0.355: v1(63.75,30.73) 49.15,30.73 48.9,30.47 v1(48.9,29.33) ; v1(38.35,29.46) 28.83,29.46 28.32,28.95 28.32,26.92 27.69,26.28 24.13,26.28 23.22,25.37 23.22,19.57 24,18.79 U2.1 27.63,18.79 R7.1 ; v1(74.82,30.71) 74.7,30.58 U4.39
  Bottom Layer w0.355: v1(74.82,30.71) 63.77,30.71 v1(63.75,30.73) ; v1(38.35,29.46) 38.48,29.33 v1(48.9,29.33)
MCU_TX2: length 47.7
  Top Layer w0.355: U2.4 28.58,22.6 28.96,22.22 28.96,19.3 29.34,18.91 v1(36.45,18.91) ; U4.6 51.02,17.99 50.86,18.15 v1(50.8,18.15)
  Bottom Layer w0.355: v1(50.8,18.15) 50.8,18.53 50.42,18.91 v1(36.45,18.91)
P00: length 44.5
  Top Layer w0.355: R48.2 57.55,50.56 58.17,51.17 68.45,51.17 69.22,50.41 69.22,46.98 69.47,46.73 73.41,46.73 73.9,46.23 U4.40
P01: length 35.2
  Top Layer w0.355: U4.41 73.1,45.76 72.77,46.09 68.83,46.09 68.58,46.35 68.58,49.9 68.07,50.41 65.28,50.41 65.02,50.16 65.02,49.25 R47.2
P02: length 18.3
  Top Layer w0.355: U4.42 72.3,26.24 72.01,26.53 64.13,26.53 63.65,26.05 63.65,23.99 63.35,23.69 60.43,23.69 60.07,23.34 60.07,22.52 60.05,22.5
P03: length 25
  Top Layer w0.355: U4.43 71.5,25.39 71.12,25.77 65.02,25.77 64.52,25.26 64.52,20.84 64.16,20.49 55.35,20.49 54.99,20.84 54.99,22.48 54.97,22.5
P04: length 26.9
  Top Layer w0.355: 52.43,22.5 52.58,22.35 52.58,20.24 52.93,19.88 64.77,19.88 65.13,20.24 65.13,24.86 65.41,25.14 70.61,25.14 70.7,25.05 U4.44
P05: length 34.7
  Top Layer w0.355: R43.2 61.21,49.17 61.21,48.25 61.42,48.04 67.34,48.04 67.69,47.69 v1(67.69,27.42) ; U4.1 67.79,21.99 67.69,22.09 v1(67.69,24.12)
  Bottom Layer w0.355: v1(67.69,24.12) v1(67.69,27.42)
P06: length 7.1
  Top Layer w0.355: v1(63.63,22.47) 62.62,22.47 62.59,22.5 ; v1(66.17,22.34) 66.17,22.09 67.07,21.19 U4.2
  Bottom Layer w0.355: v1(66.17,22.34) 63.75,22.34 v1(63.63,22.47)
P07: length 12.8
  Top Layer w0.355: v1(66.04,20.82) 66.47,20.39 U4.3 ; v1(59.94,21.33) 58.04,21.33 57.51,21.86 57.51,22.5
  Bottom Layer w0.355: v1(66.04,20.82) 65.41,21.45 60.07,21.45 v1(59.94,21.33)
P10: length 42.3
  Top Layer w0.355: U4.4 66.56,19.59 66.21,19.24 52.13,19.24 51.47,19.9 51.47,23.2 51.13,23.54 38.41,23.54 38.1,23.23 38.1,22.6 ; 38.1,22.6 38.1,22.39 C23.2 38.1,22.3 D4.3 ; 38.1,22.6 37.85,22.34 R16.1
P11: length 34.5
  Top Layer w0.355: U4.5 66.62,18.79 66.46,18.63 51.72,18.63 50.55,19.8 v1(50.55,20.44) ; 43.94,20.63 46.93,20.63 v1(47.12,20.44) ; 43.94,20.63 43.52,20.63 ; 43.94,20.63 arc(43.64,20.51) 43.52,20.21 ; 43.94,20.63 arc(43.64,20.75) 43.52,21.05 ; 43.52,21.05 43.52,20.63 ; 43.52,21.05 C22.2 R15.1 ; 43.52,20.63 43.52,20.21 ; D6.3 43.52,18.73 43.52,20.21
  Bottom Layer w0.355: v1(50.55,20.44) v1(47.12,20.44)
P12: length 30
  Top Layer w0.355: R14.1 C21.2 48.9,20.13 ; 48.9,19.22 48.9,19.61 ; 48.9,19.22 D5.3 ; 48.9,19.22 arc(49.03,19.54) 49.35,19.68 ; 48.9,19.61 48.96,19.68 49.35,19.68 ; 48.9,19.61 48.9,20.13 ; 49.35,19.68 49.66,19.68 49.91,19.42 49.91,17.67 50.39,17.19 U4.7 ; 49.35,19.68 arc(49.03,19.81) 48.9,20.13
P13: length 29.6
  Top Layer w0.355: U4.8 55.13,16.39 54.74,15.99 54.74,3.8 54.36,3.42 51.9,3.42 R36.1
P14: length 37.2
  Top Layer w0.355: R37.1 46.1,3.4 46.1,2.28 46.23,2.15 54.99,2.15 55.37,2.53 55.37,15.36 55.6,15.59 U4.9
P15: length 43.1
  Top Layer w0.355: U4.10 56.33,14.79 55.98,14.44 55.98,1.62 55.63,1.26 41.32,1.26 40.97,1.62 R38.1
P16: length 48.8
  Top Layer w0.355: U4.11 57.05,13.99 56.64,13.58 56.64,1.01 56.13,0.5 36.19,0.5 35.81,0.88 35.81,3.39 R39.1
P17_DQ: length 54.6
  Top Layer w0.355: v1(49.78,7.99) 49.78,4.69 49.53,4.44 28.58,4.44 27.94,5.07 26.62,5.07 26.54,5.15 ; U4.12 70.7,9.22 70.49,9.01 v1(57.78,9.01) ; 26.54,5.15 R23.2 ; 26.54,5.15 26.54,2.53
  Bottom Layer w0.355: v1(57.78,9.01) 57.78,8.12 57.66,7.99 v1(49.78,7.99)
P25: length 21.2
  Top Layer w0.355: LD1.2 87.87,35.04 78.23,35.04 77.9,34.71 U4.35
P26: length 28
  Top Layer w0.355: U4.36 77.1,40.52 77.98,41.39 87.88,41.39 LD4.2
P27: length 35.2
  Top Layer w0.355: LD3.2 87.81,47.87 85.98,47.87 85.47,47.36 85.47,44.19 85.22,43.93 76.58,43.93 76.3,43.65 U4.37
P30: length 4.7
  Top Layer w0.355: U4.18 75.5,7.87 R11.2
P31: length 5.2
  Top Layer w0.355: R13.2 77.09,7.85 77.09,8.37 76.96,8.5 76.58,8.5 76.3,8.78 U4.19
P33: length 26.7
  Top Layer w0.355: 90.09,10.59 90.09,10.95 ; 90.09,10.59 90.09,10.5 ; 90.09,10.59 arc(90.2,10.84) 90.44,10.95 ; 90.09,10.95 89.65,10.95 ; 90.09,10.95 90.44,10.95 ; C24.1 91.79,10.95 90.44,10.95 ; 89.65,10.95 R40.1 88.47,10.91 78.23,10.91 77.9,11.25 U4.21 ; 89.65,10.95 arc(89.96,10.81) 90.09,10.5 ; 90.09,10.5 90.09,3.12 90.44,2.77 S1.1
P37: length 12.4
  Top Layer w0.355: R65.1 85.83,18.26 85.6,18.03 85.6,15.74 85.45,15.59 U4.25
PAD: length 291
  Top Layer w0.61: v1(117.47,51.43) 117.98,50.92 117.98,11.55 117.35,10.91 107.31,10.91 106.81,10.41 106.81,4.18 105.54,2.91 98.58,2.91 NOREF#2.45
  Top Layer w0.914: NOREF#4.45 3.22,2.99 1.91,4.31 1.91,69.46 3.68,71.24 19.56,71.24 ; v1(39.37,70.48) 39.37,70.51 38.64,71.24 19.56,71.24 ; 19.56,71.24 20,70.8 NOREF.45 ; 97.01,70.48 NOREF#3.45 ; 97.01,70.48 116.97,70.48 117.98,69.46 117.98,62.98 117.86,62.86 v1(117.86,62.73) ; 97.01,70.48 v1(68.83,70.48)
  Bottom Layer w0.61: v1(117.47,51.43) 117.86,51.81 v1(117.86,62.73)
  Bottom Layer w0.914: v1(39.37,70.48) v1(68.83,70.48)
RS485_A: length 8.6
  Top Layer w0.254: CN2.10 6.63,22.7 7.69,21.64 TD1.1 14.27,21.64 14.59,21.96
RS485_B: length 8.5
  Top Layer w0.254: CN2.11 7.45,19.74 14.11,19.74 14.57,19.27
RS485_DIR: length 77.3
  Top Layer w0.355: v1(75.44,31.74) 75.69,31.49 75.69,29.33 75.5,29.14 U4.38 ; U2.2 27.81,20.06 27.94,20.18 27.94,21.47 R34.2 27.76,21.33 U2.3 24,21.33 23.83,21.51 23.83,24.96 24.51,25.65 28.7,25.65 29.08,26.03 29.08,28.06 29.46,28.44 v1(35.31,28.44) ; v1(62.74,31.61) 47.88,31.61 47.37,31.11 v1(47.37,28.44)
  Bottom Layer w0.355: v1(35.31,28.44) v1(47.37,28.44) ; v1(75.44,31.74) 62.87,31.74 v1(62.74,31.61)
RST: length 17.7
  Top Layer w0.355: U4.13 71.5,8.5 71.25,8.25 62.99,8.25 62.61,7.87 62.61,6.33 R12.2 62.62,6.29 C18.2
SUN_IN: length 8.6
  Top Layer w0.355: Q1.8 7.75,61.21 ; Q1.6 7.75,63.75 ; 7.75,65.02 Q1.5 ; Q1.7 7.75,62.48
V_BAT: length 89.1
  Top Layer w0.61: R65.2 92.42,19.01 92.57,19.15 U11.3 97.16,19.15 97.16,21.45 96.9,21.71 95.44,21.71 U11.1 94.63,21.69 94.36,21.96 v1(94.36,23.61) 94.36,25.65 94.49,25.77 97.66,25.77 97.79,25.9 97.79,26.8 R61.2 97.74,26.79 U10.1 ; R16.2 v1(36.58,24.38)
  Bottom Layer w0.61: v1(94.36,23.61) 79.88,23.61 79.5,23.99 79.5,27.04 78.87,27.68 70.1,27.68 69.34,26.92 69.34,23.36 69.09,23.11 66.8,23.11 65.53,24.38 v1(36.58,24.38)
V_SUN: length 46.6
  Top Layer w0.61: v1(52.07,56) 50.34,56 R22.1 50.25,56.03 R24.2 ; R15.2 40.83,43.74 41.15,44.06 48.9,44.06 49.78,44.95 49.78,50.79 50.04,51.05 v1(52.07,51.05)
  Bottom Layer w0.61: v1(52.07,51.05) v1(52.07,56)
VLOAD: length 13.5
  Top Layer w0.914: CN2.7 8.49,34.13 8.89,34.54 8.89,41.27 9.14,41.52 11.05,41.52 11.3,41.27 D8.2
VREF: length 17.5
  Top Layer w0.61: v1(94.23,15.23) 94.23,13.2 94.62,12.82 92.71,12.82 92.39,13.14 U12.2 ; R62.2 R63.1 92.42,20.6 92.6,20.42 93.75,20.42 ; U11.2 93.75,20.42 ; 93.75,20.42 93.74,20.44 v1(93.73,20.44)
  Bottom Layer w0.61: v1(94.23,15.23) 94.23,19.93 v1(93.73,20.44)
$1N2053: length 5.2
  Top Layer w0.355: Q1.4 14.48,65.02 14.22,65.27 14.22,66.41 14.48,66.67 15.49,66.67 15.62,66.79 15.62,67.76 R25.1
$1N2084: length 3.3
  Top Layer w0.355: CN1.2 75.38,5.63 R11.1
$1N2093: length 3.4
  Top Layer w0.355: R13.1 77.24,2.68 77.53,2.39
$1N2207: length 3.7
  Top Layer w0.355: LD1.1 94.17,35.01 R17.2
$1N2215: length 3.7
  Top Layer w0.355: LD4.1 94.18,41.42 R51.2
$1N2216: length 3.7
  Top Layer w0.355: R50.2 94.17,47.96 LD3.1
$1N2229: length 3.1
  Top Layer w0.254: U2.6 17.78,21.33 17.04,22.07 R18.2
$1N2230: length 3.1
  Top Layer w0.254: R19.2 17.25,19.27 18.03,20.06 U2.7
$1N2239: length 24.7
  Top Layer w0.61: 115.88,43.17 116.51,43.17 116.59,43.24 ; 115.88,43.17 115.7,43.17 ; 115.88,43.17 arc(116.38,42.96) 116.59,42.47 ; U3.8 105.53,43.3 105.66,43.17 115.36,43.17 ; D3.2 116.46,42.07 arc(116.14,42.85) 115.36,43.17 ; 115.7,43.17 115.36,43.17 ; 115.7,43.17 arc(116.15,43.36) 116.33,43.81
  Top Layer w1.219: C9.1 116.59,44.7 D2.2
$1N2244: length 5.8
  Top Layer w0.254: X1.2 105.53,34.28 U3.1
$1N2247: length 5.7
  Top Layer w0.254: X1.1 106.8,34.03 U3.2
$1N2268: length 8.1
  Top Layer w0.355: Q2.5 45.59,67.43 ; 44.32,69.46 44.32,67.43 ; Q2.7 43.05,67.43 ; Q2.8 41.78,67.43
$1N2272: length 26.2
  Top Layer w0.355: C29.2 44.58,48.76 43.94,48.12 27.69,48.12 27.4,48.41 U5.1
$1N2274: length 66.4
  Top Layer w0.355: U6.3 22.25,32.5 23.11,32.5 23.24,32.63 23.24,32.88 23.62,33.27 25.35,33.27 ; 25.35,33.27 27.94,33.27 28.45,33.77 v1(28.45,38.35) ; 25.35,33.27 R26.1 ; U5.8 25.4,42.03 25.53,41.9 28.07,41.9 28.45,41.52
  Top Layer w0.914: v1(28.45,40.76) 28.45,45.84 28.96,46.35 46.74,46.35 47.37,46.98 47.37,54.09 47.75,54.47 63.22,54.47 63.25,54.44
  Bottom Layer w0.355: v1(28.45,40.76) v1(28.45,38.35)
$1N2283: length 5.3
  Top Layer w0.355: R31.2 17.67,48.78 17.91,49.01 20.7,49.01 20.95,48.76 20.95,47.92 R30.1
$1N2284: length 15.8
  Top Layer w0.355: 17.67,44.63 17.67,42.39 17.78,42.28 23.11,42.28 23.37,42.54 23.37,43.6 U5.6 ; 17.67,44.63 17.67,45.22 ; 17.67,44.63 arc(17.54,44.94) 17.23,45.08 ; 17.67,45.22 17.53,45.08 17.23,45.08 ; 17.67,45.22 R31.1 arc(17.46,45.29) 16.94,45.08 ; 16.94,45.08 17.23,45.08 ; 16.94,45.08 14.99,45.08 14.84,45.22 R33.2
$1N2285: length 3
  Top Layer w0.355: C33.2 R32.2
$1N2295: length 12.6
  Top Layer w0.355: R64.1 90.37,21.22 R63.2 90.3,21.34 v1(90.3,22.34) ; U12.1 90.49,16.76 90.42,16.76 v1(90.3,16.88)
  Bottom Layer w0.355: v1(90.3,16.88) v1(90.3,22.34)
$1N2301: length 2.9
  Top Layer w0.355: U1.2 88.9,57.21
$1N2302: length 22.5
  Top Layer w0.355: U1.3 90.06,56.01 89.66,55.62 88.19,55.62 R1.1 87.94,55.36 85.85,55.36 85.47,54.98 85.47,52.06 85.09,51.68 75.44,51.68 74.95,51.2 R2.2
$1N2307: length 17.9
  Top Layer w0.355: C6.1 78.61,49.3 78.61,50.66 79.02,51.07 85.34,51.07 86.08,51.81 86.08,54.32 86.23,54.47 88.9,54.47 89.24,54.81 U1.4
$1N2310: length 13.1
  Top Layer w0.355: 82.41,49.24 82.42,49.25 82.42,50.16 82.68,50.41 85.98,50.41 86.69,51.12 86.69,53.41 86.89,53.61 U1.5
$1N2313: length 6.1
  Top Layer w0.355: C1.2 90.93,62.48 90.68,62.22 90.68,58.54 90.81,58.41 U1.1
$1N2314: length 3
  Top Layer w0.355: 96.01,60.06 96.65,59.43 96.65,58.67 96.39,58.41 U1.10
$1N2318: length 7.2
  Top Layer w0.355: R3.2 102.34,56.51 98.17,56.51 97.68,56.01 U1.8
$1N2319: length 3.1
  Top Layer w0.355: R3.1 105.49,58.61 C4.1
$1N2328: length 7.3
  Top Layer w0.355: U1.7 97.58,54.81 98.17,54.22 102.1,54.22 102.38,53.93
$1N2333: length 16.5
  Top Layer w0.355: R61.1 97.29,29.33 U10.3 94.56,29.33 93.34,29.33 92.96,29.71 92.96,31.49 92.71,31.74 86.61,31.74 86.21,31.34 R60.1
$1N2421: length 3.2
  Top Layer w0.355: Q4.1 51.72,5.59 R36.2
$1N2422: length 3.1
  Top Layer w0.355: Q5.1 46.16,5.49 R37.2
$1N2423: length 3.1
  Top Layer w0.355: Q6.1 40.97,8.51 R38.2
$1N2424: length 3.1
  Top Layer w0.355: R39.2 35.83,8.49 Q7.1
$1N2459: length 47.7
  Top Layer w1.219: D2.1 113.54,13.71 112.65,12.82 97.79,12.82 96.93,11.95 96.93,8.98 97.54,8.37 BT1.2
$1N2470: length 43.8
  Top Layer w0.355: Q2.4 45.59,61.33 45.85,61.08 48.39,61.08 49.02,60.44 49.02,57.01 48.9,56.89 46.35,56.89 45.97,56.51 45.97,47.74 45.47,47.24 27.81,47.24 27.4,46.82 U5.10
$1N2475: length 16.9
  Top Layer w0.355: R27.2 36.9,55.18 37.34,55.62 LD2.2
$1N2476: length 14.5
  Top Layer w0.355: LD2.3 32.26,57.65 31.62,57.01 26.03,57.01 25.81,56.79 R29.2
$1N2477: length 6.7
  Top Layer w0.355: U5.3 25.4,51.05 25.83,51.48 28.58,51.48 28.7,51.61 28.7,53.33 28.78,53.25 R27.1
$1N2478: length 4.6
  Top Layer w0.355: 25.91,53.25 R29.1 25.78,53.12 25.78,52.19 25.65,52.06 24.72,52.06 24.4,51.74 U5.4
$1N2479: length 3.6
  Top Layer w0.355: R32.1 22.99,53 22.99,51.93 23.4,51.52 U5.5

## Copper pours and planes (outline as drawn; the poured copper is in the pictures)
GND on Top Layer: -7.37,76.95 128.14,76.95 128.14,-6.87 -7.37,-6.87
GND on Bottom Layer: -9.53,78.22 131.95,78.22 131.95,-8.77 -9.53,-8.77
VBAT on Top Layer: 10.8,33.77 13.97,33.77 13.97,30.22 10.8,30.22
VBAT on Top Layer: 4.7,46.98 27.69,46.98 27.69,38.58 4.7,38.58
VDD on Top Layer: 95.2,67.17 114.05,67.17 114.05,33.77 95.2,33.77
VDD on Bottom Layer: 35.3,16.63 50.88,16.63 50.88,9.01 35.3,9.01
VIN on Top Layer: 16.76,68.19 48.39,68.19 48.39,57.27 16.76,57.27
PE on Top Layer: 5.21,16.37 16.51,16.37 16.51,11.68 5.21,11.68
SUN_IN on Top Layer: 4.95,65.52 8.13,65.52 8.13,55.47 4.95,55.47
$1N2057 on Top Layer: 10.16,37.33 18.8,37.33 18.8,34.03 10.16,34.03
$1N2268 on Top Layer: 41.4,71.24 51.15,71.24 51.15,67.22 41.4,67.22
$1N2271 on Top Layer: 48.13,70.35 65.91,70.35 65.91,64.13 48.13,64.13
$1N2301 on Top Layer: 71.63,59.43 90.17,59.43 90.17,55.62 71.63,55.62
$1N2314 on Top Layer: 96.01,67.43 103.12,67.43 103.12,59.81 96.01,59.81
$1N2314 on Top Layer: 90.55,66 96.65,66 96.65,59.43 90.55,59.43

Small or netless copper shapes (teardrops, artwork), in the pictures only: 464 on Top Layer, 52 on Bottom Layer
